# EasyEDA Pro project 万用表.eprj, board PCB1_2
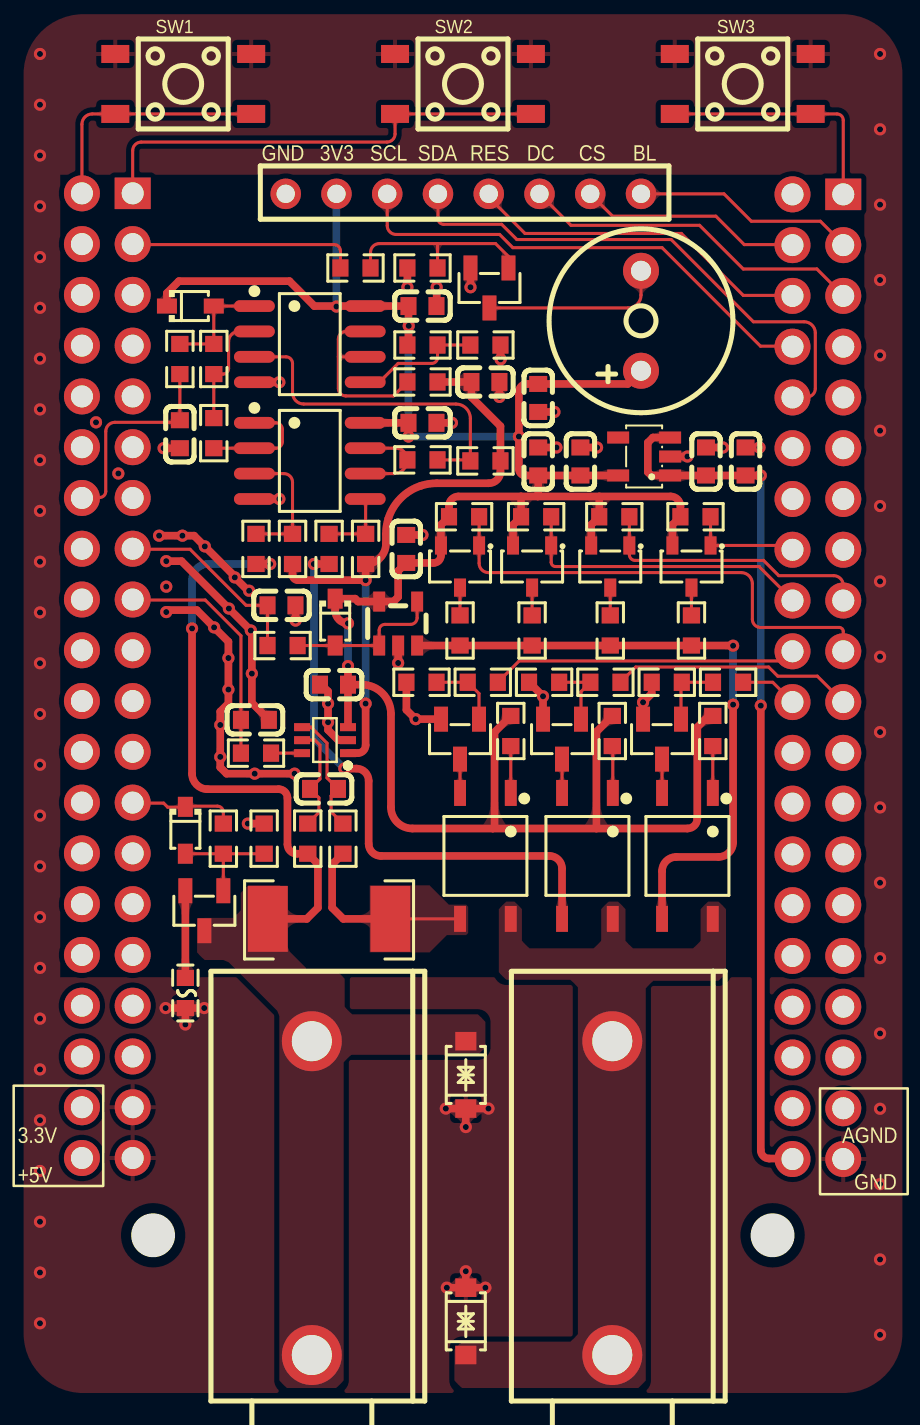
[diagram p10: board, top side]
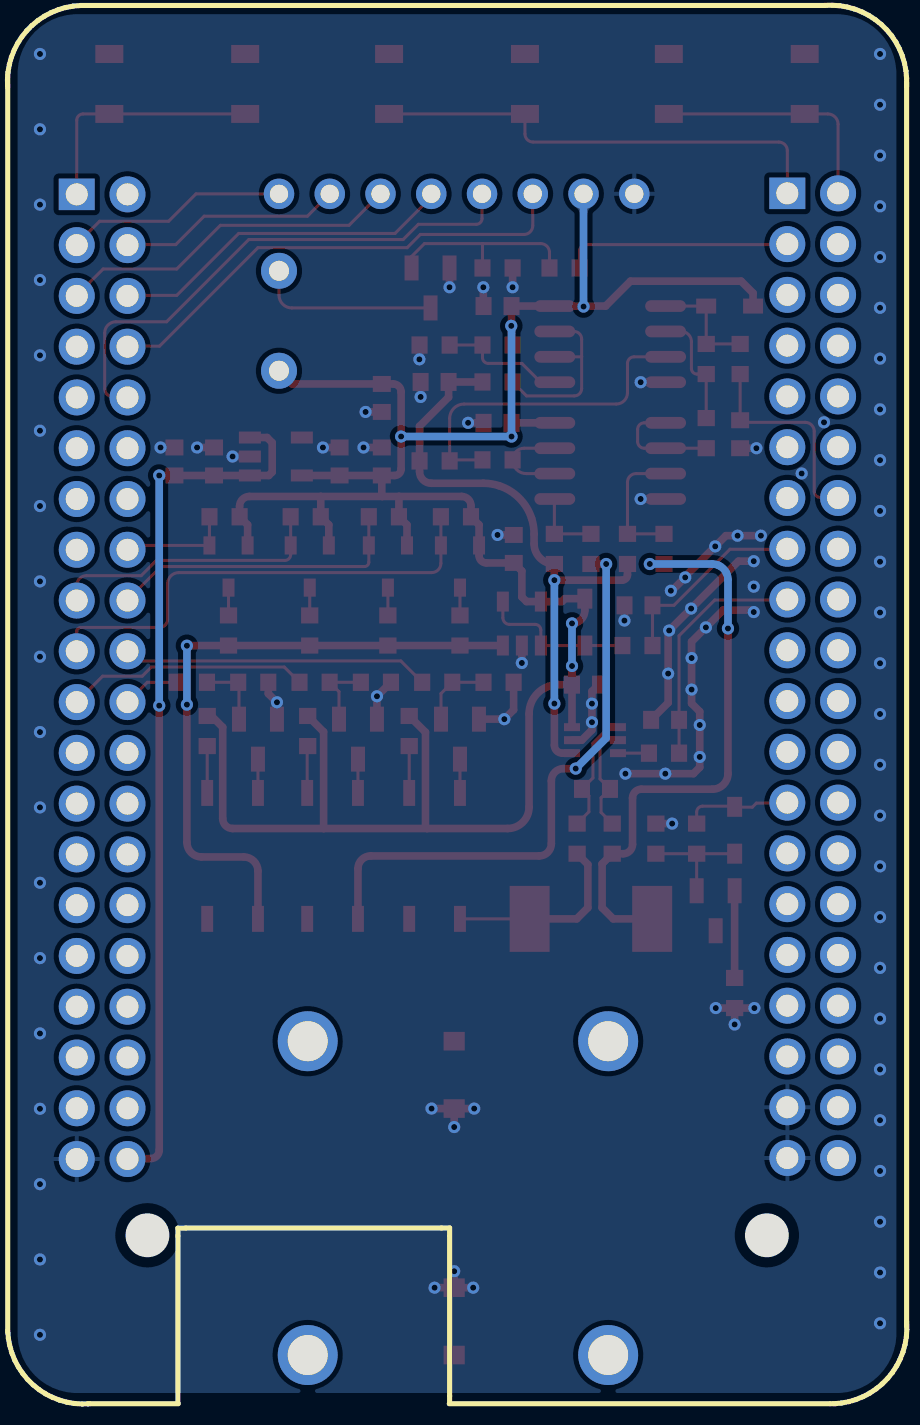
[diagram p11: board, bottom side, seen from below]

Outline 33.19 x 2.19 mm; copper layers: Top Layer, Bottom Layer. Coordinates in mm from the lower left corner of the outline.
Stack: Top Layer 0.035mm / Dielectric1 1.51mm FR4 er 4.5 / Bottom Layer 0.035mm

## Design rules (mm)
template: 自定义配置
spacing copperThickness1oz (default): track to track 0.152, other pairs 0.152 to 0.3
spacing copperThickness2oz: track to track 0.203, other pairs 0.152 to 0.3
track width copperThickness1oz (default): min 0.127, default 0.152, max 2.54
track width copperThickness2oz: min 0.203, default 0.254, max 2.54
track width power: min 0.254, default 0.381, max 2.54
differential pair differentialPair (default): width min 0.127, default 0.254, max 2.54; gap min 0.152, default 0.152
via viaSize (default): diameter min 0.5, default 0.61, max 10; hole min 0.3, default 0.305, max 6.299
net GND uses power
net +5V uses power
net VREF uses power
net BLACK_PIN uses power
net VOL_VCC uses power
net RES_VCC uses power
net +3.3V uses power

## Placement (name value [footprint] x y rotation side)
BUZZER1  3kHz  [BUZ-TH_BD9.0-P5.00-D0.6-FD]  25.51 46.85 90 top
C2  1uF  [C0603]  28.76 39.81 270 top
C3  100nF  [C0603]  30.74 39.81 270 top
C4  1uF  [C0603]  22.48 39.81 270 top
C5  100nF  [C0603]  20.37 39.81 270 top
C6  100nF  [C0603]  20.37 42.99 90 top
C7  2.2nF  [C0603]  17.73 43.79 180 top
C8  100nF  [C0603]  14.58 47.58 180 top
C9  100nF  [C0603]  14.58 41.74 180 top
C10  2.2nF  [C0603]  2.44 41.17 90 top
C11  100nF  [C0603]  13.76 35.43 270 top
C12  2.2nF  [C0603]  7.52 32.61 180 top
C13  100nF  [C0603]  10.15 28.64 0 top
C14  100nF  [C0603]  9.65 23.43 180 top
C15  2.2nF  [C0603]  6.19 26.88 180 top
CN3  24.243.2  [CONN-TH_24.243.2]  9.04 2.96 270 top
D1  SJD12C40L01  [SOD-123_L2.8-W1.8-LS3.7-BI]  16.75 9.12 90 top
D2  1N5819WS  [SOD-323_L1.8-W1.3-LS2.5-RD]  2.71 21.36 270 top
D4  1N5819WS  [SOD-323_L1.8-W1.3-LS2.5-RD]  2.96 47.58 0 top
D5  1N5819WS  [SOD-323_L1.8-W1.3-LS2.5-RD]  10.21 31.77 270 top
D7  SJD12C40L01  [SOD-123_L2.8-W1.8-LS3.7-BI]  16.75 -3.21 90 top
EVK1  LCKFB-LSPI-SkyStar-STM32F407VET6-LITE  [COMM-TH_LCKFB-LSPI-SKYSTAR-STM32F407VET6-LITE]  16.58 29.07 180 bottom
Q2  AO3401  [SOT-23-3_L2.9-W1.4-P1.90-LS2.6-BR]  28.04 34.55 90 top
Q3  AO3401  [SOT-23-3_L2.9-W1.4-P1.90-LS2.6-BR]  20.06 34.55 90 top
Q4  AO3401  [SOT-23-3_L2.9-W1.4-P1.90-LS2.6-BR]  23.97 34.55 90 top
Q5  AO3401  [SOT-23-3_L2.9-W1.4-P1.90-LS2.6-BR]  16.46 34.55 90 top
R1  10kΩ  [R0603]  11.22 49.49 180 top
R3  10kΩ  [R0603]  14.58 49.49 0 top
R5  1kΩ  [R0603]  4.61 20.94 270 top
R7  10kΩ  [R0603]  6.65 20.94 270 top
R21  10kΩ  [R0603]  28.24 37.04 180 top
R22  10kΩ  [R0603]  20.26 37.04 180 top
R23  10kΩ  [R0603]  24.18 37.04 180 top
R24  10kΩ  [R0603]  16.66 37.04 180 top
R25  100Ω  [R0603]  28.04 31.35 90 top
R26  1kΩ  [R0603]  20.06 31.35 90 top
R27  10kΩ  [R0603]  23.97 31.35 90 top
R28  100kΩ  [R0603]  16.46 31.35 90 top
R30  3Ω  [R0603]  8.84 20.94 90 top
R31  10mΩ  [RES-SMD_L6.4-W3.2-R2512]  9.9 16.93 180 top
R33  3Ω  [R0603]  10.59 20.94 90 top
R34  10Ω  [R0603]  14.58 43.79 0 top
R35  10Ω  [R0603]  2.44 44.93 270 top
R36  10Ω  [R0603]  7.57 30.6 180 top
R37  10Ω  [R0603]  6.25 25.22 180 top
R38  1kΩ  [R0603]  29.11 26.32 90 top
R39  1kΩ  [R0603]  24.08 26.32 90 top
R40  1kΩ  [R0603]  19 26.32 90 top
R41  10kΩ  [R0603]  26.8 28.76 0 top
R42  10kΩ  [R0603]  20.66 28.76 0 top
R43  10kΩ  [R0603]  14.53 28.76 0 top
R44  2.2kΩ  [R0603]  8.07 35.43 90 top
R45  2.2kΩ  [R0603]  11.73 35.43 270 top
R46  47kΩ  [R0603]  6.25 35.43 270 top
R47  47kΩ  [R0603]  9.9 35.43 270 top
R48  1kΩ  [R0603]  14.58 39.89 180 top
R49  1kΩ  [R0603]  17.73 39.84 180 top
R50  1kΩ  [R0603]  4.13 41.22 270 top
R51  1kΩ  [R0603]  4.13 44.93 270 top
R52  10kΩ  [R0603]  14.58 45.63 180 top
R53  10kΩ  [R0603]  17.73 45.63 180 top
R54  1kΩ  [R0603]  29.87 28.76 180 top
R55  1kΩ  [R0603]  23.73 28.76 180 top
R56  1kΩ  [R0603]  17.59 28.76 180 top
SW1  TS-1009S-03826  [SW-SMD_4P-L4.5-W4.5-P3.00-LS7.0_TS-1009S-03826]  2.6 58.69 180 top
SW2  TS-1009S-03826  [SW-SMD_4P-L4.5-W4.5-P3.00-LS7.0_TS-1009S-03826]  16.6 58.69 180 top
SW3  TS-1009S-03826  [SW-SMD_4P-L4.5-W4.5-P3.00-LS7.0_TS-1009S-03826]  30.6 58.69 180 top
U1  1.8寸TFT屏模块-8Pin  [1.8寸TFT屏模块-8PIN]  -0.9 -1.41 0 top
U2  LP5907MFX-3.3/NOPB  [SOT-23-5_L3.0-W1.7-P0.95-LS2.8-BR]  25.67 40.06 0 top
U4  2N7002K  [SOT-23-3_L2.9-W1.3-P1.90-LS2.4-BL-1]  3.66 17.33 180 top
U5  BSMD0603-010-36V  [F0603]  2.71 13.22 90 top
U11  TP181A1-CR  [SC70-6_L2.1-W1.3-P0.65-LS2.3-BL]  9.7 25.87 90 top
U14  GAQY211G2S  [SOP-4_L4.4-W4.0-P2.54-LS7.0-TL]  27.84 20.08 270 top
U15  GAQY211G2S  [SOP-4_L4.4-W4.0-P2.54-LS7.0-TL]  22.83 20.08 270 top
U16  GAQY211G2S  [SOP-4_L4.4-W4.0-P2.54-LS7.0-TL]  17.73 20.08 270 top
U17  SS8050  [SOT-23-3_L2.9-W1.3-P1.90-LS2.4-BR]  26.57 25.92 90 top
U18  SS8050  [SOT-23-3_L2.9-W1.3-P1.90-LS2.4-BR]  21.56 25.92 90 top
U19  SS8050  [SOT-23-3_L2.9-W1.3-P1.90-LS2.4-BR]  16.46 25.92 90 top
U20  TLV2333IDR  [SOIC-8_L4.9-W3.9-P1.27-LS6.0-BL]  8.94 39.84 270 top
U21  TLV2333IDR  [SOIC-8_L4.9-W3.9-P1.27-LS6.0-BL]  8.94 45.68 270 top
U22  TLV333IDBVR  [SOT-23-5_L2.9-W1.6-P0.95-LS2.8-BL]  13.36 31.7 0 top
U23  24.243.1  [CONN-TH_24.243.1_RED]  24.08 2.96 270 top
U24  SS8050  [SOT-23-3_L2.9-W1.3-P1.90-LS2.4-BR]  17.93 48.49 90 top

## Footprints (pads in the part's own frame, mm; a bottom-side part is the same pattern mirrored in y, then rotated)
1.8寸TFT屏模块-8PIN
  round 1.524 hole 0.914: 1(8.636,54.61) 2(11.176,54.61) 3(13.716,54.61) 4(16.256,54.61) 5(18.796,54.61) 6(21.336,54.61) 7(23.876,54.61) 8(26.416,54.61)
BUZ-TH_BD9.0-P5.00-D0.6-FD
  round 1.8 hole 1: 1(-2.5,0) 2(2.5,0)
C0603
  rect 0.8x0.9 smd: 1(-0.7,0) 2(0.7,0)
COMM-TH_LCKFB-LSPI-SKYSTAR-STM32F407VET6-LITE
  rect 1.8x1.575 hole 1.1: 1(-19.05,24.105) 41(16.51,24.155)
  round 1.8 hole 1.1: 2(-16.51,24.105) 3(-19.05,21.564) 4(-16.51,21.564) 5(-19.05,19.024) 6(-16.51,19.024) 7(-19.05,16.485) 8(-16.51,16.485) 9(-19.05,13.944) 10(-16.51,13.944) 11(-19.05,11.405) 12(-16.51,11.405) 13(-19.05,8.864) 14(-16.51,8.864) 15(-19.05,6.324) 16(-16.51,6.324) 17(-19.05,3.784) 18(-16.51,3.784) 19(-19.05,1.244) 20(-16.51,1.244) 21(-19.05,-1.296) 22(-16.51,-1.296) 23(-19.05,-3.836) 24(-16.51,-3.836) 25(-19.05,-6.375) 26(-16.51,-6.375) 27(-19.05,-8.915) 28(-16.51,-8.915) 29(-19.05,-11.456) 30(-16.51,-11.456) 31(-19.05,-13.995) 32(-16.51,-13.995) 33(-19.05,-16.535) 34(-16.51,-16.535) 35(-19.05,-19.076) 36(-16.51,-19.076) 37(-19.05,-21.616) 38(-16.51,-21.616) 39(-19.05,-24.155) 40(-16.51,-24.155) 42(19.05,24.155) 43(16.51,21.616) 44(19.05,21.616) 45(16.51,19.076) 46(19.05,19.076) 47(16.51,16.535) 48(19.05,16.535) 49(16.51,13.995) 50(19.05,13.995) 51(16.51,11.456) 52(19.05,11.456) 53(16.51,8.915) 54(19.05,8.915) 55(16.51,6.375) 56(19.05,6.375) 57(16.51,3.836) 58(19.05,3.836) 59(16.51,1.296) 60(19.05,1.296) 61(16.51,-1.244) 62(19.05,-1.244) 63(16.51,-3.784) 64(19.05,-3.784) 65(16.51,-6.324) 66(19.05,-6.324) 67(16.51,-8.864) 68(19.05,-8.864) 69(16.51,-11.405) 70(19.05,-11.405) 71(16.51,-13.944) 72(19.05,-13.944) 73(16.51,-16.485) 74(19.05,-16.485) 75(16.51,-19.024) 76(19.05,-19.024) 77(16.51,-21.564) 78(19.05,-21.564) 79(16.51,-24.105) 80(19.05,-24.105)
CONN-TH_24.243.1_RED
  round 3 hole 2: 1(-7.85,0) 2(7.85,0)
CONN-TH_24.243.2
  round 3 hole 2: 1(-7.85,0) 2(7.85,0)
F0603
  rect 0.806x0.864 smd: 1(-0.753,0) 2(0.753,0)
R0603
  rect 0.806x0.864 smd: 1(-0.753,0) 2(0.753,0)
RES-SMD_L6.4-W3.2-R2512
  rect 2x3.3 smd: 1(-3.067,0) 2(3.067,0)
SC70-6_L2.1-W1.3-P0.65-LS2.3-BL
  rect 0.4x0.8 smd: 1(-0.65,-1.15) 2(-0.001,-1.15) 3(0.65,-1.15) 4(0.65,1.15) 5(0,1.15) 6(-0.65,1.15)
SOD-123_L2.8-W1.8-LS3.7-BI
  rect 0.93x1.06 smd: 1(1.685,0) 2(-1.685,0)
SOD-323_L1.8-W1.3-LS2.5-RD
  rect 1x0.75 smd: 1(-1.173,0) 2(1.173,0)
SOIC-8_L4.9-W3.9-P1.27-LS6.0-BL
  oval 0.588x2.045 smd: 1(-1.905,-2.772) 2(-0.635,-2.772) 3(0.635,-2.772) 4(1.905,-2.772) 5(1.905,2.772) 6(0.635,2.772) 7(-0.635,2.772) 8(-1.905,2.772)
SOP-4_L4.4-W4.0-P2.54-LS7.0-TL
  rect 1.3x0.595 smd: 1(-3.15,1.27) 2(-3.15,-1.27) 3(3.15,-1.27) 4(3.15,1.27)
SOT-23-3_L2.9-W1.3-P1.90-LS2.4-BL-1
  rect 0.7x1.25 smd: 1(-0.95,-1) 2(0.95,-1) 3(0,1)
SOT-23-3_L2.9-W1.3-P1.90-LS2.4-BR
  rect 1.25x0.7 smd: 1(1,-0.95) 2(1,0.95) 3(-1,0)
SOT-23-3_L2.9-W1.4-P1.90-LS2.6-BR
  rect 0.91x0.6 smd: 1(1.055,-0.955) 2(1.055,0.955) 3(-1.055,0)
SOT-23-5_L2.9-W1.6-P0.95-LS2.8-BL
  rect 0.6x1 smd: 1(-0.95,-1.1) 2(0,-1.1) 3(0.95,-1.1) 4(0.95,1.1) 5(-0.95,1.1)
SOT-23-5_L3.0-W1.7-P0.95-LS2.8-BR
  rect 1.1x0.6 smd: 1(1.3,-0.95) 2(1.3,0) 3(1.3,0.95) 4(-1.3,0.95) 5(-1.3,-0.95)
SW-SMD_4P-L4.5-W4.5-P3.00-LS7.0_TS-1009S-03826
  rect 1.4x0.9 smd: 1(-3.4,1.5) 2(3.4,1.5) 3(-3.4,-1.5) 4(3.4,-1.5)

## Nets
As in the schematic.

Pads without a net: EVK1 2 7 9 11 12 13 14 15 23 24 25 26 27 28 29 30 31 32 33 34 35 36 37 38 44 45 46 47 48 49 50 51 52 53 56 58 59 60 61 62 63 64 66 67 68 69 70 71 72 73 74 75 76 78 80; U2 4

## Via types
v1: diameter 0.61, hole 0.305, Top Layer to Bottom Layer, 113 vias

## Routing (per net, layer and track width the routed paths; a pad name or vN(x,y) marks a point on that pad's centre or on a via; arc(x,y) is an arc through that point)
+3.3V: length 129.2
  Top Layer w0.381: 10.85,26.52 C13.2 ; C13.2 v1(10.85,29.57) ; C13.2 11.54,28.64 arc(12.57,28.22) 13,27.18 13,22.52 arc(13.31,21.76) 14.07,21.45 18.1,21.45 ; BUZZER1.1 24.85,43.69 C6.2 19.8,43.69 arc(19.52,43.57) 19.4,43.29 v1(19.4,41.06) 19.4,39.43 arc(19.5,39.2) 19.73,39.11 C5.2 ; 20.34,38.06 23.42,38.06 ; 20.34,38.06 19.51,38.06 ; 20.34,38.06 20.37,38.08 C5.2 ; 23.42,38.06 R23.2 23.02,36.64 23.02,35.61 ; 23.42,38.06 26.99,38.06 arc(27.34,37.91) 27.49,37.57 R21.2 27.08,36.64 Q2.2 ; U2.5 C4.2 C5.2 ; R39.2 23.28,26.28 23.28,21.45 ; 23.28,21.45 27.84,21.45 arc(28.19,21.59) 28.33,21.94 28.33,26.51 28.89,27.08 R38.2 ; 23.28,21.45 18.1,21.45 ; 18.1,21.45 18.18,21.53 18.18,26.26 R40.2 ; 13.88,41 C9.2 U20.8 ; 19.51,38.06 16.37,38.06 arc(16.04,37.92) 15.9,37.59 R24.2 15.5,36.64 Q5.2 15.5,35.1 arc(15.39,34.84) 15.13,34.73 C11.2 13.36,34.33 13.36,33.03 13.13,32.8 11.35,32.8 11.21,32.94 D5.1 10.21,32.35 arc(10.4,31.9) v1(10.85,31.71) ; 19.51,38.06 19.51,37.04 19.11,36.64 Q3.2 ; R52.2 13.88,45.69 C8.2 U21.8 9.17,47.58 7.92,48.83 2.38,48.83 1.79,48.23 D4.1
  Bottom Layer w0.381: v1(13.89,46.59) 13.88,46.58 v1(13.88,41.06) v1(19.4,41.06) ; U1.2 v1(10.27,47.56) ; v1(10.85,29.57) v1(10.85,31.71)
+5V: length 44
  Top Layer w0.381: v1(31.51,27.59) 31.51,5.35 arc(31.63,5.06) 31.92,4.94 33.09,4.94 ; v1(31.51,39.11) C3.2 C2.2 U2.1 26.02,39.11 25.85,39.28 25.85,40.75 26.11,41.01 U2.3
  Bottom Layer w0.381: v1(31.51,39.11) v1(31.51,27.59)
GND: length 66.7
  Top Layer w0.381: R7.1 v1(5.84,21.69) ; R3.1 v1(13.82,48.52) ; v1(18.49,44.92) 18.48,44.93 R53.1 ; U5.1 v1(2.71,11.64) ; U5.1 v1(1.72,12.46) ; U5.1 v1(3.65,12.46) ; C3.1 v1(31.44,40.51) ; C11.1 v1(14.58,36.13) ; v1(1.4,36.1) v1(2.56,36.1) 3.15,36.1 v1(3.68,35.56) 5.18,34.06 v1(5.18,34.01) 5.85,33.34 v1(5.9,33.34) ; C7.1 v1(18.43,43.04) ; U18.2 v1(20.61,28.06) R42.1 ; v1(8.23,31.85) 8.23,32.61 C12.1 ; U20.4 v1(7.41,37.93) ; U21.4 v1(7.41,43.77) ; D1.2 v1(17.88,7.44) ; D1.2 v1(16.75,6.51) ; D1.2 v1(15.74,7.44) ; U17.2 v1(25.62,27.76) 26.05,28.19 R41.1 ; U2.2 v1(27.84,40.06) ; C6.1 v1(21.18,42.29) ; C5.1 v1(21.28,40.51) ; C9.1 v1(16.05,41.74) ; C8.1 15.29,47.59 v1(15.29,48.52) ; 16.75,-1.52 v1(17.73,-1.52) ; 16.75,-1.52 v1(15.8,-1.52) ; 16.75,-1.52 v1(16.75,-0.7) ; U19.2 v1(14.24,26.92) 13.77,27.38 R43.1 ; C4.1 v1(23.31,40.51) ; C2.1 v1(29.61,40.51) ; U22.2 v1(13.36,29.73) ; C15.1 6.04,27.74 v1(6.04,29.2) 6.04,31.3 v1(5.99,31.35) v1(4.89,32.45) 2.52,34.82 v1(1.75,34.82) ; C13.1 9.51,28.64 9.85,28.3 v1(9.85,27.7) v1(9.85,26.76) 9.85,26.37 10.36,25.87 10.85,25.87 ; v1(1.75,32.27) 1.85,32.37 3.28,32.37 v1(4.15,31.51) 4.87,30.79 v1(4.87,29.98) v1(4.87,28.4) 4.87,27.7 4.46,27.3 v1(4.46,26.63) v1(4.46,25.03) 4.46,24.5 4.77,24.19 v1(6.18,24.19) v1(8.18,24.19) ; C10.1 v1(1.62,40.47) ; U24.2 v1(16.98,48.52)
  vias: v1(-4.57,60.19) v1(-4.57,57.65) v1(-4.57,55.11) v1(-4.57,52.57) v1(-4.57,50.03) v1(-4.57,47.49) v1(-4.57,44.95) v1(-4.57,42.41) v1(-4.57,39.87) v1(-4.57,37.33) v1(-4.57,34.79) v1(-4.57,32.25) v1(-4.57,29.71) v1(-4.57,27.17) v1(-4.57,24.63) v1(-4.57,22.09) v1(-4.57,19.55) v1(-4.57,17.01) v1(-4.57,14.47) v1(-4.57,11.93) v1(-4.57,9.39) v1(-4.57,6.85) v1(-4.57,4.31) v1(-4.57,1.77) v1(-4.57,-0.77) v1(-4.57,-3.31) v1(-1.76,41.77) v1(-0.64,39.21) v1(1.75,33.55) v1(37.48,60.19) v1(37.48,56.42) v1(37.48,52.66) v1(37.48,48.89) v1(37.48,45.12) v1(37.48,41.35) v1(37.48,37.58) v1(37.48,33.81) v1(37.48,30.04) v1(37.48,26.27) v1(37.48,22.5) v1(37.48,18.73) v1(37.48,14.96) v1(37.48,11.19) v1(37.48,7.42) v1(37.48,3.66) v1(37.48,-0.11) v1(37.48,-3.88)
BLACK_CON: length 5.4
  Top Layer w0.152: R5.1 4.61,22.27 arc(4.52,22.48) 4.31,22.56 2.74,22.56 D2.1 2.69,22.51 1.83,22.51 1.62,22.72 0.07,22.72
BLACK_PIN: length 29.5
  Top Layer w0.381: v1(3.04,31.45) 3.04,24.19 arc(3.27,23.64) 3.82,23.41 7.38,23.41 arc(7.69,23.28) 7.82,22.98 7.82,20.65 arc(7.96,20.32) 8.29,20.19 R30.1 9.34,19.68 9.34,17.48 8.79,16.93 R31.2 ; v1(6.96,34.68) R46.2
  Bottom Layer w0.381: v1(6.96,34.68) 3.84,34.68 arc(3.67,34.66) 3.5,34.61 arc(3.28,34.45) 3.12,34.22 arc(3.06,34.06) 3.04,33.89 v1(3.04,31.45)
BUZZER: length 11.4
  Top Layer w0.152: 0.07,50.66 10.16,50.66 arc(10.38,50.56) 10.47,50.34 R1.2
CON_1K: length 15.2
  Top Layer w0.152: R22.1 Q3.1 21.02,34.77 arc(21.08,34.62) 21.23,34.55 31.42,34.55 33.09,32.88
CON_10K: length 14.1
  Top Layer w0.152: 35.63,32.88 35.63,33.61 arc(35.49,33.95) 35.15,34.1 32.41,34.1 31.65,34.86 25.22,34.86 arc(25.01,34.94) 24.93,35.15 Q4.1 R23.1
CON_100K: length 24.2
  Top Layer w0.152: 35.63,30.34 35.63,31.3 arc(35.57,31.45) 35.43,31.51 31.49,31.51 arc(31.21,31.62) 31.09,31.91 31.09,33.69 arc(30.92,34.08) 30.53,34.25 17.88,34.25 arc(17.55,34.39) 17.41,34.72 Q5.1 17.41,37.04
CON_100R: length 5.6
  Top Layer w0.152: 33.09,35.42 32.9,35.61 28.99,35.61 28.99,37.04
CUR_CON: length 15.4
  Top Layer w0.152: EVK1.20 32.61,29.83 19.41,29.83 R56.1
CUR_VCC: length 9.6
  Top Layer w0.152: R31.1 U16.3
  Top Layer w0.381: R33.1 10.06,19.65 10.06,17.48 10.61,16.93 R31.1
ELECTRICITY_PIN: length 12
  Top Layer w0.152: R37.2 C15.2 5.49,31.09 3.71,32.88 0.07,32.88
KEY1: length 12.2
  Top Layer w0.152: SW1.1 SW1.2 -1.95,57.19 arc(-2.31,57.04) -2.47,56.68 -2.47,53.2
KEY2: length 23.6
  Top Layer w0.152: 0.07,53.2 0.07,55.36 arc(0.2,55.66) 0.5,55.79 12.8,55.79 arc(13.08,55.91) 13.2,56.19 SW2.2 SW2.1
KEY3: length 12.3
  Top Layer w0.152: 35.63,53.2 35.63,56.88 arc(35.54,57.1) 35.32,57.19 SW3.1 SW3.2
RES_CON: length 2.9
  Top Layer w0.152: EVK1.22 32.1,28.76 R54.1
RES_VCC: length 32.4
  Top Layer w0.381: v1(30.12,27.64) 30.12,20.75 arc(29.91,20.24) 29.39,20.02 27.28,20.02 arc(26.77,19.82) 26.57,19.31 U14.3 ; v1(30.12,30.59) 30.11,30.6 R25.1 R27.1 R26.1 R28.1 U22.3
  Bottom Layer w0.381: v1(30.12,27.64) v1(30.12,30.59)
RESISTANCE_PIN: length 9.9
  Top Layer w0.152: 0.07,35.42 2.94,35.42 5.75,32.61 C12.2 R36.2
SPI_BL: length 11.2
  Top Layer w0.152: 35.63,50.66 35.63,50.68 34.49,51.83 31.04,51.83 29.66,53.2 U1.8
SPI_CS: length 11.2
  Top Layer w0.152: U1.7 24.09,52.08 29.26,52.08 30.68,50.66 33.09,50.66
SPI_DC: length 17.3
  Top Layer w0.152: U1.6 22.01,51.62 28.44,51.62 30.63,49.44 34.31,49.44 35.63,48.12
SPI_RES: length 17.4
  Top Layer w0.152: U1.5 17.89,53.03 19.71,51.22 27.53,51.22 30.63,48.12 33.09,48.12
SPI_SCL: length 24.4
  Top Layer w0.152: 33.09,45.58 31.49,45.58 26.57,50.5 19.1,50.5 18.44,51.16 13.26,51.16 arc(12.94,51.29) 12.81,51.61 U1.3
SPI_SDA: length 26.8
  Top Layer w0.152: U1.4 15.35,51.96 arc(15.44,51.76) 15.64,51.67 18.54,51.67 19.3,50.91 27.02,50.91 31.14,46.8 33.68,46.8 arc(34.07,46.63) 34.24,46.24 34.24,43.45 arc(34.11,43.16) 33.82,43.04 33.09,43.04
VOL_CON: length 12.2
  Top Layer w0.152: EVK1.21 34.34,29.07 32.36,29.07 31.9,29.52 25.25,29.52 R55.1
VOL_VCC: length 29.2
  Top Layer w0.381: R47.2 v1(9.14,34.68) ; U15.3 21.56,19.44 arc(21.38,19.89) 20.93,20.08 12.49,20.08 arc(12.06,20.25) 11.88,20.68 11.88,23.83 arc(11.71,24.27) 11.27,24.44 v1(10.66,24.44)
  Bottom Layer w0.381: v1(9.14,34.68) 9.14,25.97 v1(10.66,24.44)
VOLTAGE_PIN: length 10.8
  Top Layer w0.152: R35.2 C10.2 2.44,41.77 -0.82,41.77 arc(-1.14,41.63) -1.27,41.31 -1.27,38.31 arc(-1.36,38.1) -1.58,38.01 -2.41,38.01 arc(-2.45,37.99) -2.47,37.96
VREF: length 30.9
  Top Layer w0.381: C7.2 17.03,43.03 18.48,41.57 R49.1 18.48,39.3 arc(18.31,38.89) 17.9,38.72 15.29,38.72 arc(14.89,38.69) 14.5,38.59 arc(13.49,37.97) 12.87,36.96 arc(12.78,36.58) 12.75,36.18 12.75,35.7 arc(12.45,34.98) R45.2 v1(11.73,33.87) 8.34,33.87 arc(8.15,33.95) 8.07,34.14 R44.1 ; R34.2 17.03,43.79 ; v1(11.73,27.7) 11.73,25.61 arc(11.62,25.33) 11.33,25.22 10.85,25.22
  Bottom Layer w0.381: v1(11.73,27.7) v1(11.73,33.87)
$2N837: length 10
  Top Layer w0.152: 15.33,50.71 18.23,50.71 18.88,50.06 U24.1 ; 15.33,50.71 12.42,50.71 arc(12.11,50.58) 11.98,50.27 R1.1 ; 15.33,50.71 R3.2
$2N838: length 9.2
  Top Layer w0.152: BUZZER1.2 25.51,48.13 arc(25.32,47.68) 24.87,47.49 U24.3
$3N410: length 5.8
  Top Layer w0.152: R5.2 U4.1 ; R5.2 2.71,20.19 ; R5.2 R7.2
$3N411: length 4.4
  Top Layer w0.381: U5.2 U4.2
$3N4546: length 2.3
  Top Layer w0.152: 29.11,23.23 R38.1
$3N4550: length 2.4
  Top Layer w0.152: R39.1 24.1,25.54 U15.1
$3N4555: length 2.3
  Top Layer w0.152: U16.1 R40.1
$3N5537: length 1.7
  Top Layer w0.152: U17.3 U14.2
$3N5732: length 1.7
  Top Layer w0.152: U15.2 21.56,24.92
$3N5836: length 1.7
  Top Layer w0.152: U16.2 U19.3
$3N10755: length 3.4
  Top Layer w0.152: U17.1 27.52,28.72 R41.2 R54.2
$3N10799: length 3.6
  Top Layer w0.152: U18.1 22.51,28.29 R55.2 R42.2
$3N10842: length 3.6
  Top Layer w0.152: 15.28,28.76 R56.2 17.41,28.2 U19.1
$4N965: length 6.6
  Top Layer w0.152: U20.3 7.64,39.2 arc(7.95,39.07) 8.07,38.77 R44.2 R46.1
$4N967: length 3.6
  Top Layer w0.152: R47.1 R45.1 11.73,37.91 U20.5
$4N972: length 5.8
  Top Layer w0.152: R50.2 U20.2 7.24,40.47 arc(7.47,40.57) 7.57,40.8 7.57,41.41 arc(7.47,41.64) 7.24,41.74 U20.1
$4N973: length 6
  Top Layer w0.152: U21.2 5.38,46.31 arc(5.02,46.16) 4.87,45.8 4.87,44.46 arc(4.79,44.26) 4.59,44.18 R51.2 R50.1
$4N974: length 17
  Top Layer w0.152: R48.1 16.92,39.89 R49.2 16.97,41.96 arc(16.76,42.47) 16.25,42.68 8.64,42.68 arc(8.24,42.85) 8.07,43.25 8.07,44.71 arc(7.98,44.95) 7.74,45.04 U21.3
$4N985: length 6.4
  Top Layer w0.152: R53.2 R52.1 15.33,45.01 arc(15.24,44.8) 15.04,44.71 13.36,44.71 12.42,43.77 U21.5
$4N994: length 5.6
  Top Layer w0.152: U21.1 D4.2 R51.1 R35.1
$4N1465: length 6.2
  Top Layer w0.152: R33.2 10,22.28 10,23.08 C14.1 9.8,23.98 9.8,25.71 9,26.52 U11.4
$4N1467: length 5.5
  Top Layer w0.152: U11.5 9.19,25.87 9.45,25.61 9.45,23.92 C14.2 9.39,22.98 9.39,22.25 R30.2
$4N1481: length 1.6
  Top Layer w0.152: R37.1 U11.6
$4N2338: length 1.4
  Top Layer w0.152: R25.2 Q2.3
$4N2342: length 1.4
  Top Layer w0.152: R26.2 Q3.3
$4N2344: length 1.4
  Top Layer w0.152: R27.2 Q4.3
$4N2348: length 1.4
  Top Layer w0.152: R28.2 Q5.3
$4N2381: length 7.9
  Top Layer w0.152: R36.1 D5.2 12.41,30.6 12.41,31.37 arc(12.49,31.57) 12.7,31.66 13.98,31.66 arc(14.21,31.75) 14.31,31.99 U22.4
$4N19267: length 9.3
  Top Layer w0.152: U21.7 10.75,46.31 arc(10.48,46.2) 10.37,45.93 10.37,45.04 ; R34.1 13.13,43.09 10.74,43.09 arc(10.48,43.2) 10.37,43.46 10.37,45.04 ; U21.6 10.37,45.04
$4N19289: length 5
  Top Layer w0.152: U20.6 13.14,39.2 arc(13.62,39.4) R48.2 arc(13.65,40.3) 13.24,40.47 U20.7

## Copper pours and planes (outline as drawn; the poured copper is in the pictures)
GND on Top Layer: -7.06,63.97 39.93,63.97 39.93,-8.07 -7.06,-8.07
GND on Bottom Layer: -7.06,63.97 39.93,63.97 39.93,-8.07 -7.06,-8.07
BLACK_PIN on Top Layer: 3.3,18.6 17.73,18.6 17.73,-6.54 3.3,-6.54
CUR_VCC on Top Layer: 11.93,18.6 16.86,18.6 16.86,15.25 11.93,15.25
$3N4308 on Top Layer: 16.18,17.79 29.77,17.79 29.77,-6.54 16.18,-6.54

Small or netless copper shapes (teardrops, artwork), in the pictures only: 202 on Top Layer, 14 on Bottom Layer

## Text on the board
Top Silkscreen Layer: 3.3V | +5V | GND | 3V3 | SCL | SDA | RES | DC | CS | BL | AGND
